# Altium schematic sheet MOSFETPowerStage.SchDoc
size A4
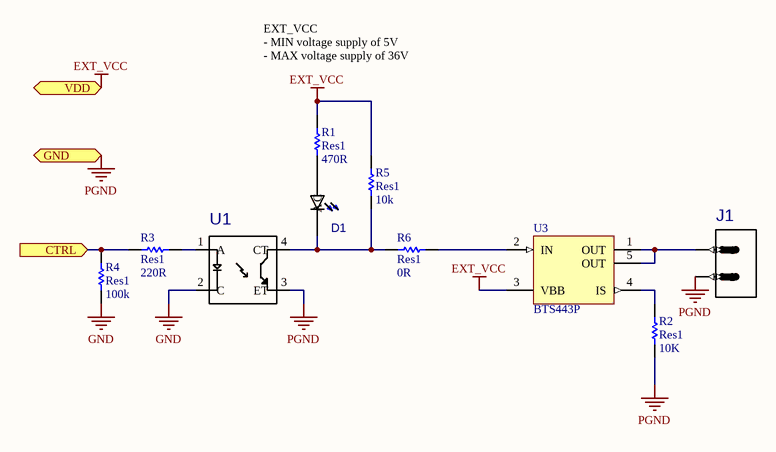
[diagram p0: MOSFETPowerStage.SchDoc]

## Parts
D1  0805_LED  [LEDSC200X125X70-2N_598-8160-107F(Primary)]  (value not drawn)
J1  1760510000  [1760490000]  (value not drawn)
R1  Res1  value 470R  [6-0805_N]
R2  Res1  value 10K  [6-0805_N]
R3  Res1  value 220R  [6-0805_N]
R4  Res1  value 100k  [6-0805_N]
R5  Res1  value 10k  [6-0805_N]
R6  Res1  value 0R  [6-0805_N]
U1  PC817X2NIP0F  [SOT254P975X400-4N]  (value not drawn)
U3  BTS443P  [INF-PG-TO252-5-11_N]

## Ports
CTRL (in), GND, VDD

## Nets
EXT_VCC: R1.1 R5.1 U3.3(VBB) ; port VDD
GND: R4.2 U1.2(C)
PGND: J1.2 R2.2 U1.3(ET) ; port GND
CTRL: R3.1 R4.1 ; port CTRL
NetD1_A: D1.A R1.2
NetD1_C: D1.C R5.2 R6.1 U1.4(CT)
NetJ1_1: J1.1 U3.1(OUT) U3.5(OUT)
NetR2_1: R2.1 U3.4(IS)
NetR3_2: R3.2 U1.1(A)
NetR6_2: R6.2 U3.2(IN)

## Notes on the sheet
- EXT_VCC
  - MIN voltage supply of 5V
  - MAX voltage supply of 36V

## Library data of the parts
D1 = 598-8160-107F: LED, SMD; 0805; Yellow-Green; Water Clear Lens; 40mcd; 570/575nm; MF: Dialight; Package: 0805 Dialight; MP: 598-8160-107F; Price: 0.09 USD; Availability: Good; Value: *
J1 = 1760510000: Conn Terminal Block 2 POS 5.08mm Solder ST Thru-Hole 16A; MF: Weidmuller; Package: None; MP: 1760510000; Price: 0.43 USD; Availability: Good; Value: *
R1-R6 = Res1: Resistor; Published: 8-Jun-2000; LatestRevisionDate: 17-Jul-2002; LatestRevisionNote: Re-released for DXP Platform.; PackageReference: AXIAL-0.3; Publisher: Altium Limited; PackageDescription: Axial Device, Thru-Hole; 2 Leads; 0.3 in Pin Spacing
U1 = PC817X2NIP0F: PC817 Series 1 Channel 80 V 5000 Vrms General Purpose Photocoupler - DIP-4; MF: Sharp Microelectronics; Availability: Good; Price: 0.30 USD; Package: PDIP-4 Sharp Microelectronics; MP: PC817X2NIP0F; Value: *
U3 = BTS443P: Smart High-Side Power Switch, 1 Channel, 7.6 A Load Current, -40 to 150 degC, PG-TO252-5-11, Reel, Green; Manufacturer: Infineon; Channels: 1; Green: TRUE; Group: Automotive Qualified; Load Current (typ): 7.6 A; Ptot (max): 42 W; Recommended Operating Voltage Max.: 36 V; Recommended Operating Voltage Min.: 5 V; RON @ 25degreesC: 16 mOhm; RON(max) @ 150degreesC: 31 mOhm; toff (max): 410 us; DatasheetVersion: Rev. 1.0; PackageVersion: Nov-10; PackageReference: PG-TO252-5-11; PackageDescription: 5-Pin Plastic (Green) Transistor Single Outline Package, 6.5 x 6.12 mm Body, 1.14 mm Pitch; Supplier 1: Mouser; Supplier Part Number 1: 726-BTS443P; Supplier 2: Newark; Supplier Part Number 2: 58M4071; Supplier 3: Farnell; Supplier Part Number 3: 1440808; Supplier 4: Farnell; Supplier Part Number 4: 1440808RL; Supplier 5: Digi-Key; Supplier Part Number 5: BTS443PINTR-ND; Supplier 6: Digi-Key; Supplier Part Number 6: BTS443PINCT-ND; Supplier 7: Digi-Key; Supplier Part Number 7: BTS443PINDKR-ND; Halogen-free: TRUE; Packing: Reel; ton (max): 410 us; Mounting Technology: Surface Mount; PartNumber: BTS443P; ComponentLink1Description: Manufacturer URL; ComponentLink1URL: http://www.infineon.com/; ComponentLink2Description: Datasheet; ComponentLink2URL: http://www.infineon.com/dgdl/BTS443P_DS_v10.pdf?folderId=db3a304314dca389011537739e37155f&fileId=db3a3043183a9555011860442f5b3616&location=en.Products.Automotive_ICs.Smart_High-_and_Low-Side_Switches.PROFET__-_Smart_High_Side_Switches.DATASHEET.BTS443P_DS_v10.pdf; ComponentLink3Description: Package Specification; ComponentLink3URL: http://www.infineon.com/dgdl/TLE7276-Data+Sheet-+v1_11.pdf?folderId=db3a304412b407950112b408e8c90004&fileId=db3a304412b407950112b436c53f66c8&sId=db3a30433db6f09f013dc0e43c0428c1